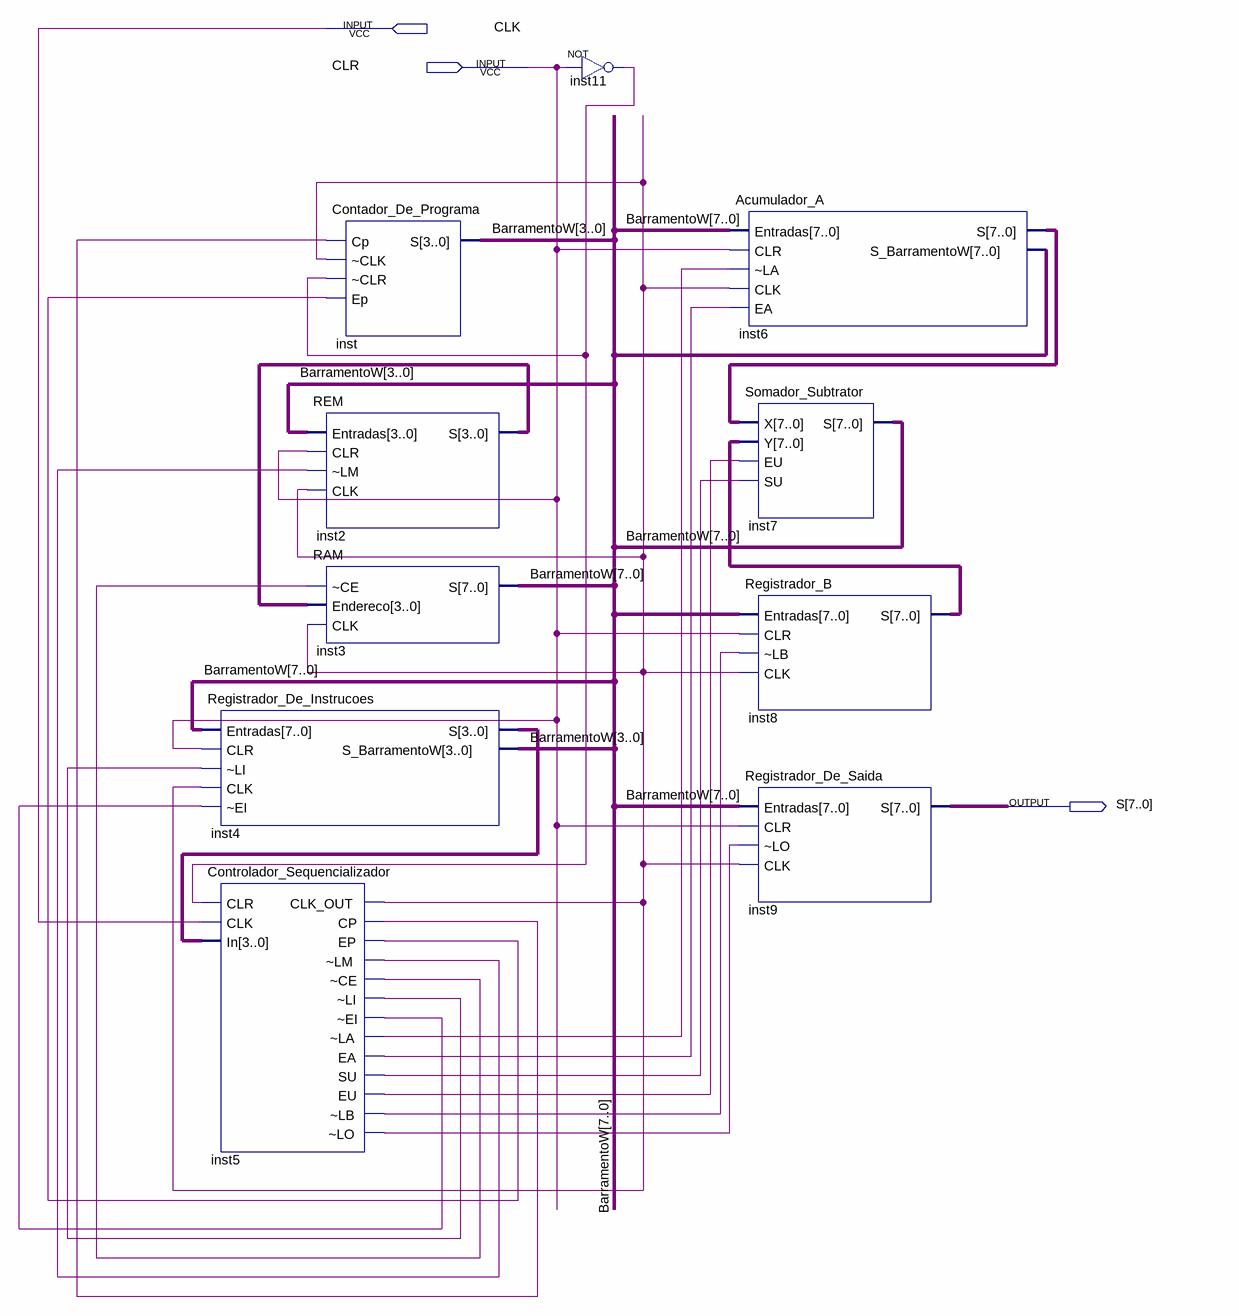
[diagram p0: schematic sheet]
// Quartus schematic Microcomputador.bdf as structural Verilog: 10 symbols, 3 pins
module Microcomputador (
  input  CLK,
  input  CLR,
  output [7:0] S
);

  wire inst5__ce, inst5__ei, inst5__la, inst5__lb, inst5__li, inst5__lm, inst5__lo, inst5_clk_out, inst5_cp,
       inst5_ea, inst5_ep, inst5_eu, inst5_su, inst11_out;
  wire [3:0] inst2_s, inst4_s;
  wire [7:0] BarramentoW, inst6_s, inst8_s;

  Registrador_De_Instrucoes inst4 (
    .Entradas(BarramentoW), .CLR(CLR), .\~LI (inst5__li), .CLK(inst5_clk_out), .\~EI (inst5__ei),
    .S(inst4_s), .S_BarramentoW(BarramentoW[3:0]));
  Controlador_Sequencializador inst5 (
    .CLR(inst11_out), .CLK(CLK), .In(inst4_s), .CLK_OUT(inst5_clk_out), .CP(inst5_cp), .EP(inst5_ep),
    .\~LM (inst5__lm), .\~CE (inst5__ce), .\~LI (inst5__li), .\~EI (inst5__ei), .\~LA (inst5__la),
    .EA(inst5_ea), .SU(inst5_su), .EU(inst5_eu), .\~LB (inst5__lb), .\~LO (inst5__lo));
  REM inst2 (.Entradas(BarramentoW[3:0]), .CLR(CLR), .\~LM (inst5__lm), .CLK(inst5_clk_out), .S(inst2_s));
  RAM inst3 (.\~CE (inst5__ce), .Endereco(inst2_s), .CLK(inst5_clk_out), .S(BarramentoW));
  Contador_De_Programa inst (
    .Cp(inst5_cp), .\~CLK (inst5_clk_out), .\~CLR (inst11_out), .Ep(inst5_ep), .S(BarramentoW[3:0]));
  not inst11 (inst11_out, CLR);
  Acumulador_A inst6 (
    .Entradas(BarramentoW), .CLR(CLR), .\~LA (inst5__la), .CLK(inst5_clk_out), .EA(inst5_ea), .S(inst6_s),
    .S_BarramentoW(BarramentoW));
  Somador_Subtrator inst7 (.X(inst6_s), .Y(inst8_s), .EU(inst5_eu), .SU(inst5_su), .S(BarramentoW));
  Registrador_B inst8 (.Entradas(BarramentoW), .CLR(CLR), .\~LB (inst5__lb), .CLK(inst5_clk_out), .S(inst8_s));
  Registrador_De_Saida inst9 (.Entradas(BarramentoW), .CLR(CLR), .\~LO (inst5__lo), .CLK(inst5_clk_out), .S(S));
endmodule
